# EAGLE design psu_v2 (EAGLE 5.12)
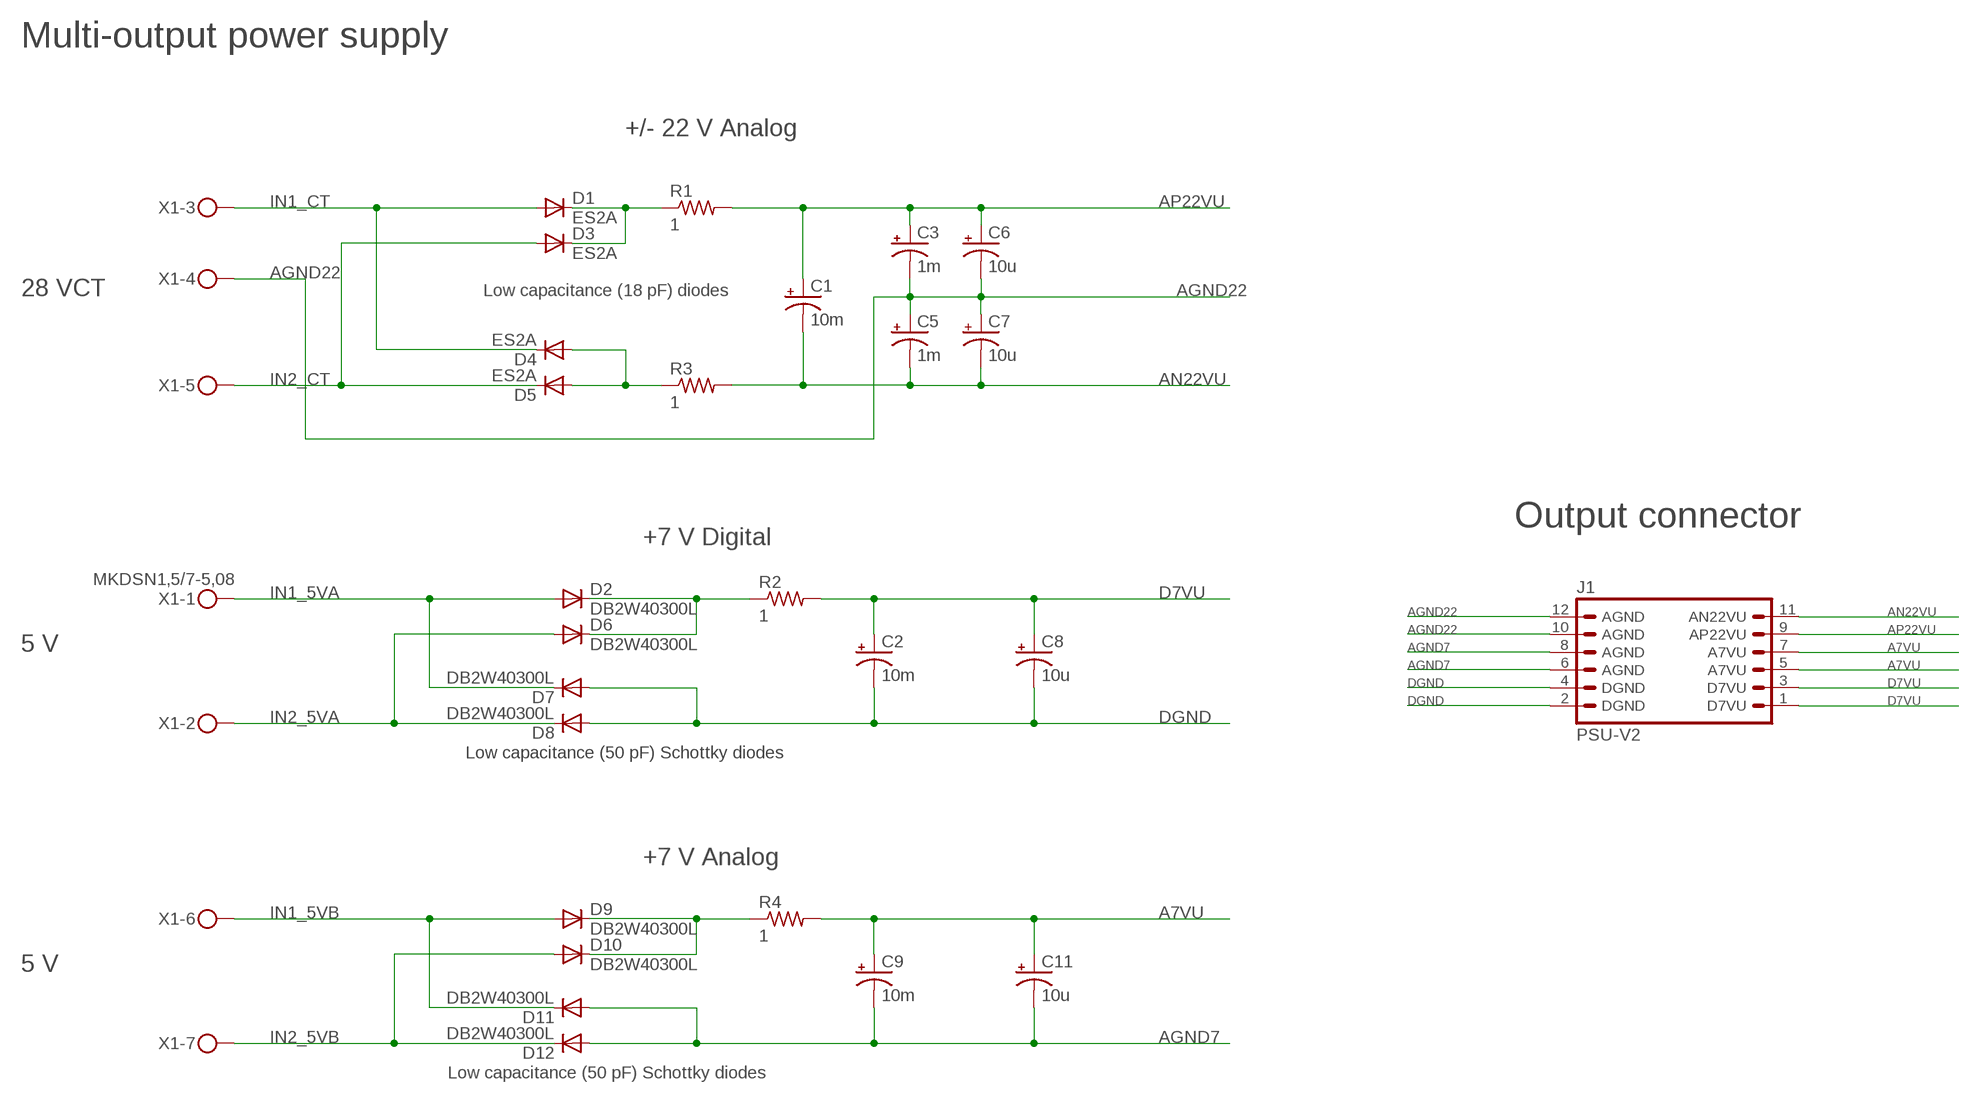
[diagram p0: schematic, sheet 1]

## Parts
C1  10m  CPOL-USE10-30  [EB30D]
C2  10m  CPOL-USE10-22.5  [EB22,5D]
C3  1m  CPOL-USE5-13  [E5-13]
C5  1m  CPOL-USE5-13  [E5-13]
C6  10u  CPOL-USCT6032  [CT6032]
C7  10u  CPOL-USCT6032  [CT6032]
C8  10u  CPOL-USCT6032  [CT6032]
C9  10m  CPOL-USE10-22.5  [EB22,5D]
C11  10u  CPOL-USCT6032  [CT6032]
D1  ES2A  DIODE-DO214AA  [DO214AA]
D2  DB2W40300L  DIODE-SOD123  [SOD123]
D3  ES2A  DIODE-DO214AA  [DO214AA]
D4  ES2A  DIODE-DO214AA  [DO214AA]
D5  ES2A  DIODE-DO214AA  [DO214AA]
D6  DB2W40300L  DIODE-SOD123  [SOD123]
D7  DB2W40300L  DIODE-SOD123  [SOD123]
D8  DB2W40300L  DIODE-SOD123  [SOD123]
D9  DB2W40300L  DIODE-SOD123  [SOD123]
D10  DB2W40300L  DIODE-SOD123  [SOD123]
D11  DB2W40300L  DIODE-SOD123  [SOD123]
D12  DB2W40300L  DIODE-SOD123  [SOD123]
J1  PSU-V2  [MA06-2]
R1  1  R-US_R2512  [R2512]
R2  1  R-US_R2512  [R2512]
R3  1  R-US_R2512  [R2512]
R4  1  R-US_R2512  [R2512]
X1  MKDSN1,5/7-5,08  [MKDSN1,5/7-5,08]

## Nets
A7VU: C9.+ C11.+ J1.5(A7VU) J1.7(A7VU) R4.2
AGND7: C9.- C11.- D11.A D12.A J1.6(AGND) J1.8(AGND)
AGND22: C3.- C5.+ C6.- C7.+ J1.10(AGND) J1.12(AGND) X1.4
AN22VU: C1.- C5.- C7.- J1.11(AN22VU) R3.2
AP22VU: C1.+ C3.+ C6.+ J1.9(AP22VU) R1.2
D7VU: C2.+ C8.+ J1.1(D7VU) J1.3(D7VU) R2.2
DGND: C2.- C8.- D7.A D8.A J1.2(DGND) J1.4(DGND)
IN1_5VA: D2.A D7.C X1.1
IN1_5VB: D9.A D11.C X1.6
IN1_CT: D1.A D4.C X1.3
IN2_5VA: D6.A D8.C X1.2
IN2_5VB: D10.A D12.C X1.7
IN2_CT: D3.A D5.C X1.5
N$5: D1.C D3.C R1.1
N$7: D4.A D5.A R3.1
N$10: D2.C D6.C R2.1
N$13: D9.C D10.C R4.1

## Notes on the sheet
- Multi-output power supply
- +/- 22 V Analog
- 28 VCT | Low capacitance (18 pF) diodes
- Output connector
- +7 V Digital
- 5 V
- Low capacitance (50 pF) Schottky diodes
- +7 V Analog
- 5 V
- Low capacitance (50 pF) Schottky diodes

## Library data of the parts
C1-C3 C5-C9 C11 = rcl:CPOL-US: POLARIZED CAPACITOR, American symbol
D1-D12 = diode:DIODE-: DIODE
J1 = cdp:PSU-V2
R1-R4 = rcl:R-US_: RESISTOR, American symbol
X1 = con-phoenix-508:MKDSN1,5/7-5,08: MKDSN 1,5/ 7-5,08 Printklemme Nennstrom: 13,5 A Nennspannung: 250 V Rastermaß: 5,08 mm Polzahl: 7 Anschlussart: Schraubanschluss Montage: Löten Anschlussrichtung Leiter/Platine: 0 ° Artikelnummer: 1729173 Source: http://eshop.phoenixcontact.com .. 1729173.pdf; MPN: SMKDSN1,5/7-5,08; OC_FARNELL: 1792909; OC_NEWARK: 70R0303

## Board
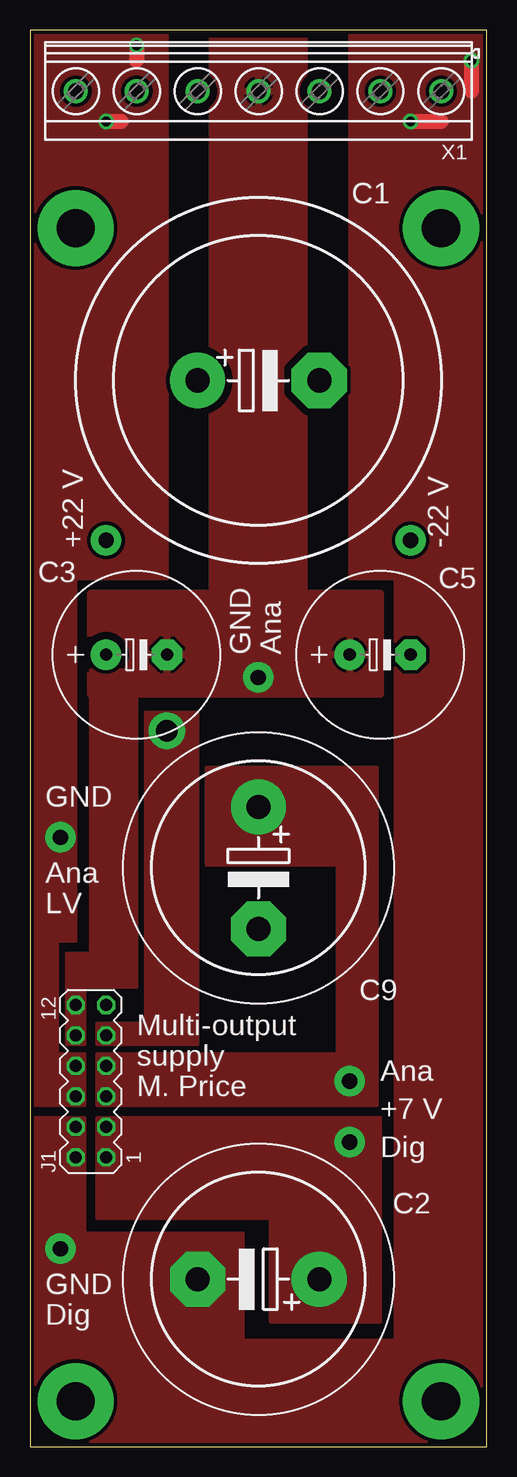
[diagram p1: board, top side]
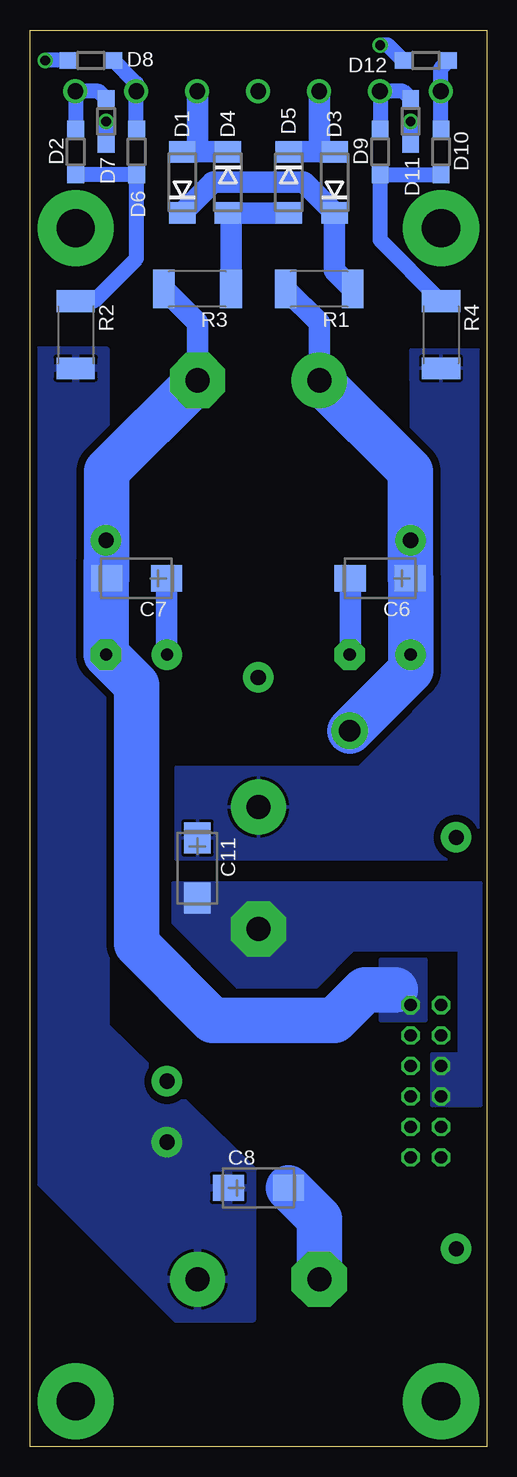
[diagram p2: board, bottom side, seen from below]

Size 38.1 x 118.11 mm. Coordinates in mm from the lower left corner, seen from the top.
Outline: 0,0 38.1,0 38.1,118.11 0,118.11 0,0
Copper layers (1*16): Top 0.035mm / dielectric 1.6mm / Bottom 0.035mm
Design rules "Elecrow_2-layer_PCB_eagle_rule_mod *": minimum track width 6mil, minimum drill 12mil, track to track 6mil, track to pad 6mil, pad to pad 6mil, via to via 8mil, smd to smd 0mil, copper to edge 12mil, drill to drill 10mil, minimum pad ring 6mil, minimum via ring 6mil, stop-mask expansion 0mil, vias tented up to drill 40mil, thermal gap 10mil

### Footprints (pad centres in the part's own frame; a part is rotated, then mirrored left to right if it is on the bottom)
EB30D = drill 2.007 pad 4.597 round: + -5.08,0 | drill 2.007 pad 4.597 octagon: - 5.08,0
EB22,5D = drill 2.007 pad 4.597 round: + -5.08,0 | drill 2.007 pad 4.597 octagon: - 5.08,0
E5-13 = drill 1.016 pad 2.54 round: + -2.54,0 | drill 1.016 pad 2.54 octagon: - 2.54,0
CT6032 = smd 2.6 x 2.2: + -2.5,0; - 2.5,0
DO214AA = smd 1.8 x 2.2: A 2.55,0; C -2.55,0
SOD123 = smd 1.4 x 1.4: A 1.9,0; C -1.9,0
MA06-2 = drill 1.016 octagon: 1 -6.35,-1.27; 2 -6.35,1.27; 3 -3.81,-1.27; 4 -3.81,1.27; 5 -1.27,-1.27; 6 -1.27,1.27; 7 1.27,-1.27; 8 1.27,1.27; 9 3.81,-1.27; 10 3.81,1.27; 11 6.35,-1.27; 12 6.35,1.27
R2512 = smd 1.8 x 3.2: 1 -2.8,0; 2 2.8,0
MKDSN1,5/7-5,08 = drill 1.3 pad 2 round: 1 -15.261,0.025; 2 -10.181,0.025; 3 -5.101,0.025; 4 -0.021,0.025; 5 5.059,0.025; 6 10.139,0.025; 7 15.219,0.025

### Placement (x,y rotation side)
C1  19.05,88.9 0 top
C2  19.05,13.97 180 top
C3  8.89,66.04 0 top
C5  29.21,66.04 0 top
C6  8.89,72.39 180 bottom
C7  29.21,72.39 180 bottom
C8  19.05,21.59 0 bottom
C9  19.05,48.26 270 top
C11  24.13,48.26 270 bottom
D1  25.4,105.41 90 bottom
D2  34.29,107.95 90 bottom
D3  12.7,105.41 90 bottom
D4  21.59,105.41 270 bottom
D5  16.51,105.41 270 bottom
D6  29.21,107.95 90 bottom
D7  31.75,110.49 270 bottom
D8  33.02,115.57 180 bottom
D9  8.89,107.95 90 bottom
D10  3.81,107.95 90 bottom
D11  6.35,110.49 270 bottom
D12  5.08,115.57 180 bottom
J1  5.08,30.48 90 top
R1  13.97,96.52 180 bottom
R2  34.29,92.71 270 bottom
R3  24.13,96.52 180 bottom
R4  3.81,92.71 270 bottom
X1  19.05,113.03 180 top

### Tracks (layer width: path | path; a pad name or v marks a point on that pad's centre or on a via)
A7VU  (via drill 1.27 pad 2.54)
  other vias: 26.67,30.48
  pour Bottom (isolate 0.61): 25.91,49.02 0,49.02 0,91.44 6.35,91.44 6.1,61.21 10.67,56.64 25.91,56.64
  pour Top (isolate 0.305, no thermals): 5.59,28.45 28.96,28.45 28.96,56.64 14.73,56.64 14.73,48.51 25.65,48.51 25.65,32.77 5.59,32.77
AGND7  (via drill 0.81 pad 1.27, 1.27 pad 2.54)
  Top 1.27: v8.89,116.84 8.89,115.57 | v6.35,110.49 7.62,110.49
  Bottom 1.27: D12.A 8.25,116.84 v8.89,116.84 | D11.A v6.35,110.49
  other vias: 2.54,50.8
  pour Top (isolate 0.305, no thermals): 0,118.11 11.43,118.11 11.43,72.39 3.81,72.39 3.81,42.16 2.29,42.16 2.29,32.77 4.57,32.77 4.57,28.45 0,28.45
  pour Bottom (isolate 0.305, no thermals): 26.16,46.99 0.51,46.99 0.51,28.45 4.57,28.45 4.57,32.77 2.29,32.77 2.29,41.4 11.18,41.4 14.22,38.35 20.83,38.35 26.16,43.69
AGND22  (via drill 1.27 pad 2.54)
  Bottom 1.778: C3.- 11.39,66.08 C6.- | C5.+ 26.71,66.08 C7.+
  other vias: 19.05,64.14
  pour Top (isolate 0.61): 15.24,118.11 22.86,118.11 22.86,71.12 29.21,71.12 29.21,62.74 5.08,62.74 5.08,71.12 15.24,71.12
  pour Top (isolate 0.305, no thermals): 5.08,64.77 5.08,41.15 3.05,41.15 3.05,33.53 4.57,33.53 4.57,38.35 8.89,38.35 8.89,64.77
AN22VU  (via drill 1.27 pad 2.54)
  Bottom 1.778: R3.2 24.13,93.72 C1.- | v31.75,75.56 31.71,75.61 31.71,77.47
  Bottom 3.81: C1.- 31.71,81.32 31.71,77.47 31.71,73.66 | 31.71,73.66 C7.- | 31.71,73.66 31.75,73.66 C5.- 29.21,63.5 29.21,41.91 22.86,35.56 12.7,35.56 10.16,38.1 7.62,38.1
  pour Bottom (isolate 0.305, no thermals): 5.08,40.64 5.08,35.56 8.89,35.56 8.89,40.64
AP22VU  (via drill 1.27 pad 2.54, 1.78 pad 3.05)
  Bottom 1.778: R1.2 13.97,93.72 C1.+ | v6.35,75.56 6.39,75.61 6.39,77.47
  Bottom 3.81: C1.+ 6.39,81.32 6.39,77.47 C6.+ 6.35,72.35 C3.+ 6.35,64.77 v11.43,59.69
  pour Top (isolate 0.305, no thermals): 5.59,33.53 5.59,35.31 9.65,35.31 9.65,61.21 13.97,61.21 13.97,33.53
D7VU  (via drill 1.27 pad 2.54)
  other vias: 26.67,25.4
  pour Bottom (isolate 0.61): 19.56,10.67 25.91,10.67 38.1,22.86 38.1,91.44 31.75,91.44 31.75,35.05 19.56,23.11
  pour Top (isolate 0.305, no thermals): 5.59,27.43 29.21,27.43 29.21,10.41 20.07,10.41 20.07,19.05 5.59,19.05
DGND  (via drill 0.81 pad 1.27, 1.27 pad 2.54)
  Top 1.27: v36.83,115.57 36.83,113.03 | v31.75,110.49 34.29,110.49
  Bottom 1.27: D8.A v36.83,115.57 | D7.A v31.75,110.49
  Bottom 3.81: C8.- 13.97,19.01 C2.-
  other vias: 2.54,16.51
  pour Top (isolate 0.305, no thermals): 26.67,118.11 38.1,118.11 38.1,0 0,0 0,27.43 4.57,27.43 4.57,17.78 17.78,17.78 17.78,8.89 30.48,8.89 30.48,72.39 26.67,72.39
IN1_5VA
  Bottom 1.27: D7.C 32.37,113 X1.1 34.29,112.98 D2.A
IN1_5VB
  Bottom 1.27: D11.C 6.96,113 X1.6 8.89,112.98 D9.A
IN1_CT
  Bottom 1.778: D4.C 24.13,107.96 | 24.13,107.96 D1.A | X1.3 24.13,112.98 24.13,107.96
IN2_5VA
  Bottom 1.27: D8.C 29.23,113.68 X1.2 29.23,109.87 D6.A
IN2_5VB
  Bottom 1.27: D12.C 3.83,114.92 X1.7 3.81,112.98 D10.A
IN2_CT
  Bottom 1.778: D3.A 13.97,107.96 | 13.97,107.96 D5.C | X1.5 13.97,112.98 13.97,107.96
N$1  (via drill 3.17 pad 6.35)
  other vias: 3.81,101.6
N$2  (via drill 3.17 pad 6.35)
  other vias: 34.29,101.6
N$3  (via drill 3.17 pad 6.35)
  other vias: 34.29,3.81
N$4  (via drill 3.17 pad 6.35)
  other vias: 3.81,3.81
N$5
  Bottom 1.778: D1.C 22.86,105.4 22.86,105.41 15.24,105.41 D3.C 12.7,98.05 R1.1
N$7
  Bottom 1.778: D5.A D4.A 21.33,102.6 R3.1
N$10
  Bottom 1.27: D2.C D6.C 29.21,99.06 32.76,95.51 R2.1
N$13
  Bottom 1.27: D10.C D9.C 8.89,100.59 R4.1

### Text on the board
tPlace: +22 V | -22 V | GND | Ana | GND | Ana | LV | Multi-output | supply | Ana | M. Price | +7 V | Dig | GND | Dig